# Altium schematic sheet ProbadorManillaresCrio.SchDoc
size A3
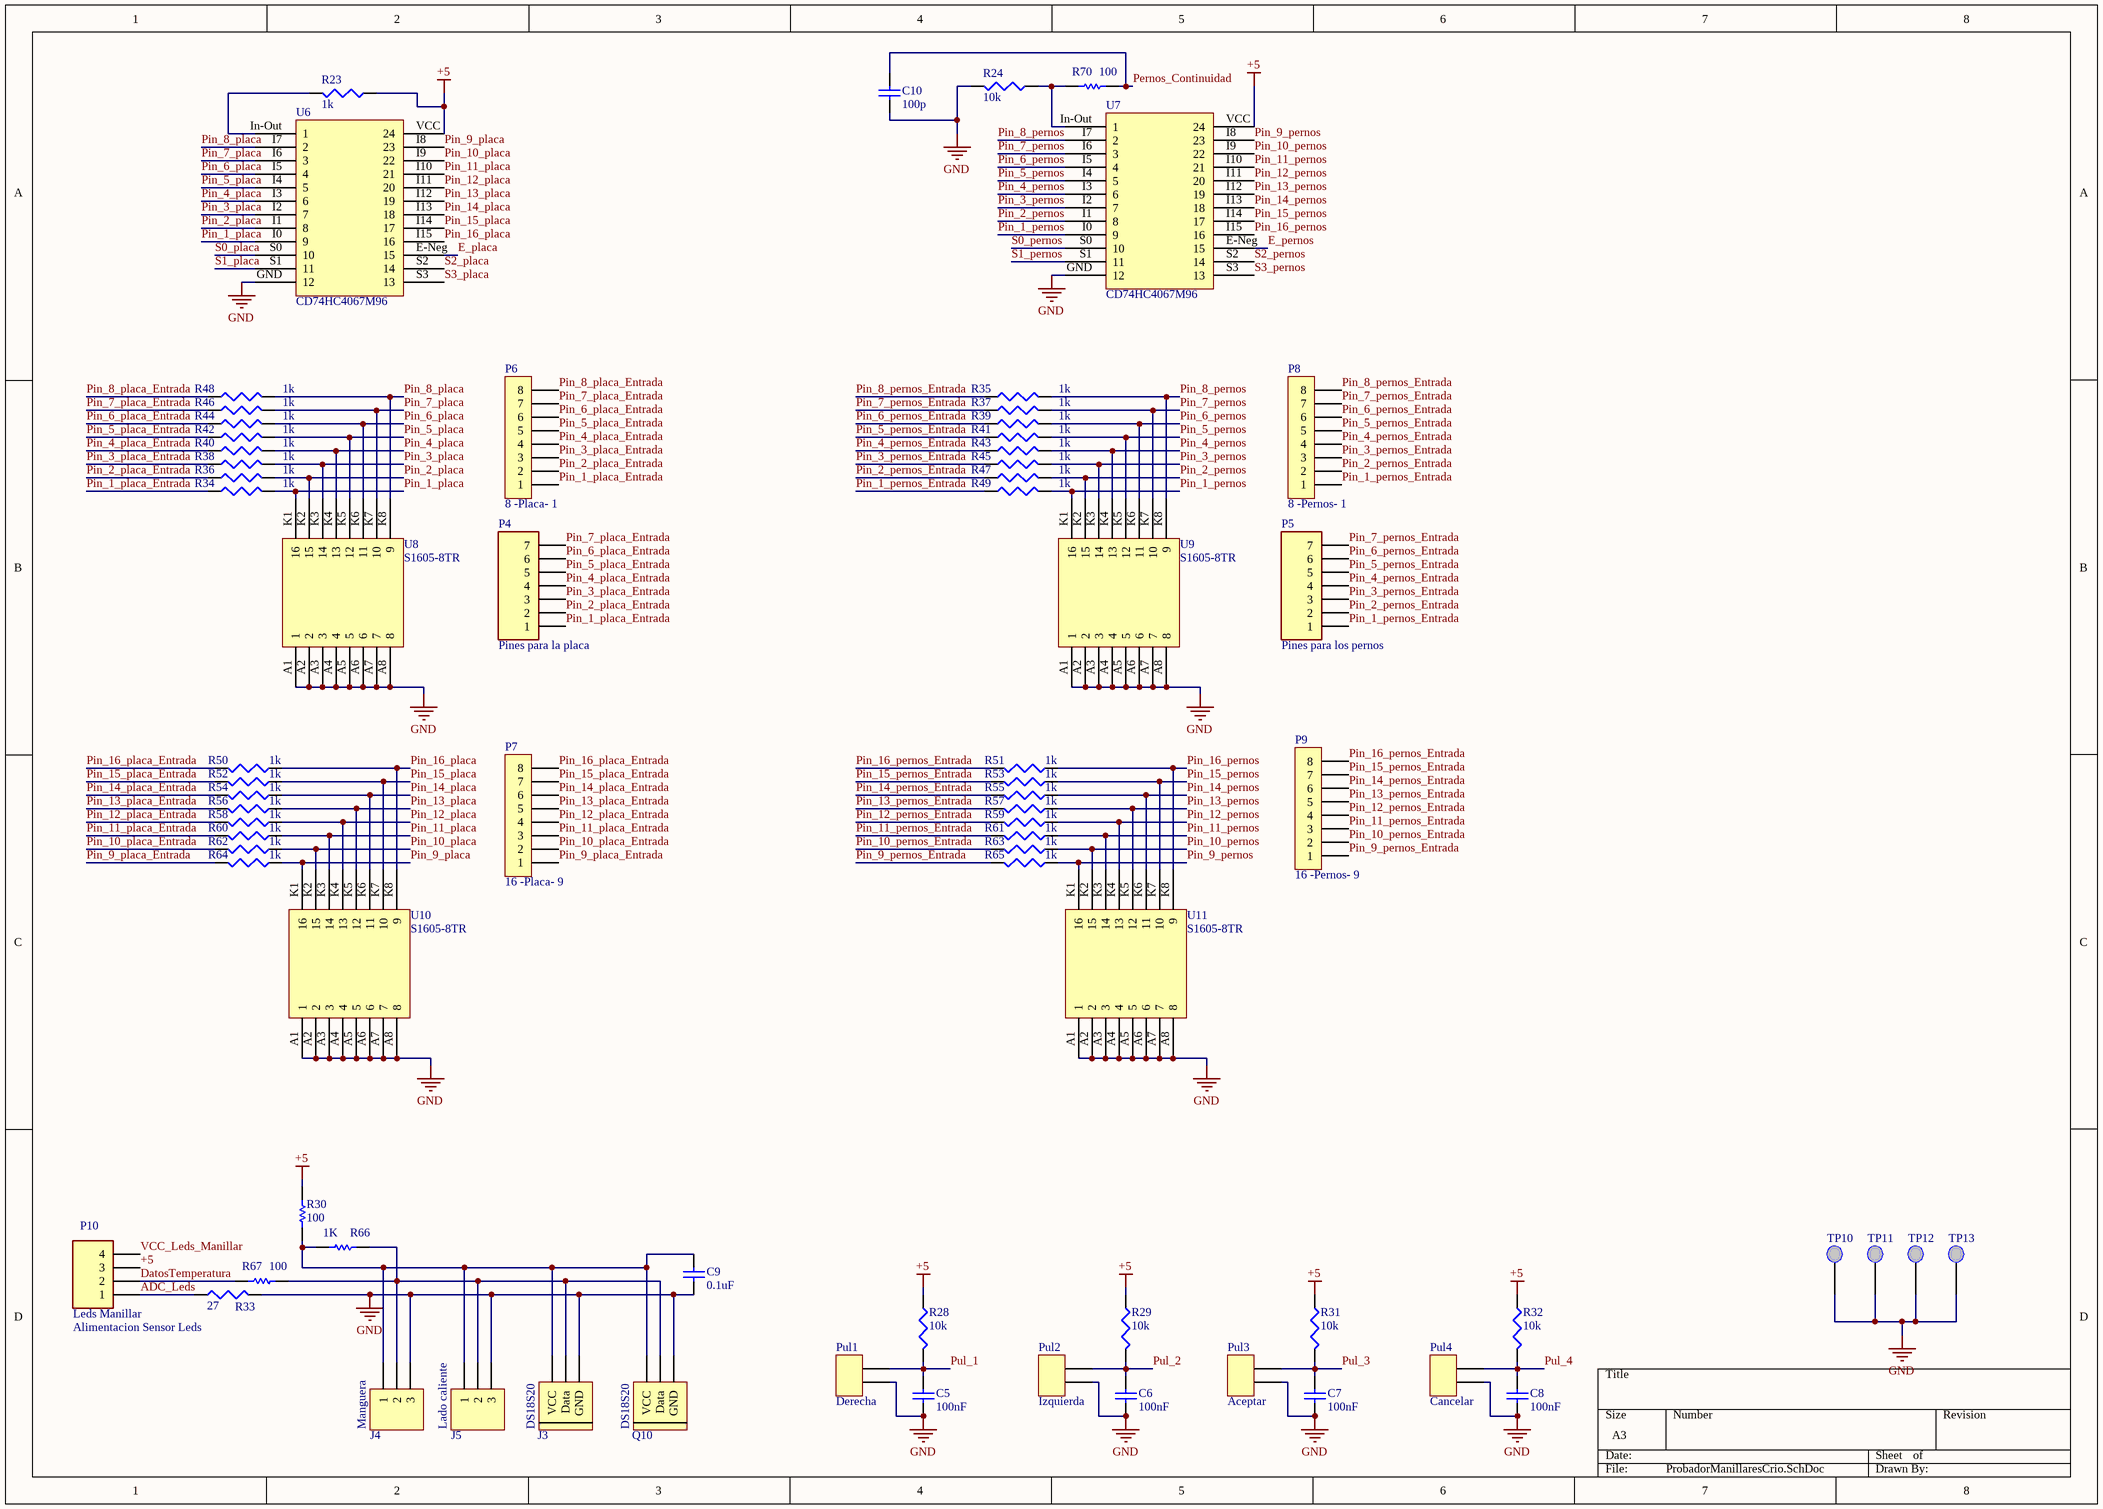
[diagram p0: ProbadorManillaresCrio.SchDoc]

## Parts
C5  100nF  [6-0805_M]
C6  100nF  [6-0805_M]
C7  100nF  [6-0805_M]
C8  100nF  [6-0805_M]
C9  0.1uF  [C_0805_3D]
C10  100p  [C_0805_3D]
J3  DS18S20  [DS18S20-ZocaloDirecto]
J4  Manguera  [B3B-XH-A_3D]
J5  Lado caliente  [B3B-XH-A_3D]
P4  Pines para la placa  [B7B-XH-A_3D]
P5  Pines para los pernos  [B7B-XH-A_3D]
P6  8 -Placa- 1  [PinesMacho8]
P7  16 -Placa- 9  [PinesMacho8]
P8  8 -Pernos- 1  [PinesMacho8]
P9  16 -Pernos- 9  [PinesMacho8]
P10  Leds Manillar  Funcion: Alimentacion Sensor Leds  [B4B-XH-A_3D]
Pul1  Derecha  [Jumper-Simple]
Pul2  Izquierda  [Jumper-Simple]
Pul3  Aceptar  [Jumper-Simple]
Pul4  Cancelar  [Jumper-Simple]
Q10  DS18S20  [TO92_123]
R23  1k  [6-0805_M]
R24  10k  [6-0805_M]
R28  10k  [6-0805_M]
R29  10k  [6-0805_M]
R30  100  [R_0805_3D]
R31  10k  [6-0805_M]
R32  10k  [6-0805_M]
R33  27  [6-0805_M]
R34  1k  [6-0805_M]
R35  1k  [6-0805_M]
R36  1k  [6-0805_M]
R37  1k  [6-0805_M]
R38  1k  [6-0805_M]
R39  1k  [6-0805_M]
R40  1k  [6-0805_M]
R41  1k  [6-0805_M]
R42  1k  [6-0805_M]
R43  1k  [6-0805_M]
R44  1k  [6-0805_M]
R45  1k  [6-0805_M]
R46  1k  [6-0805_M]
R47  1k  [6-0805_M]
R48  1k  [6-0805_M]
R49  1k  [6-0805_M]
R50  1k  [6-0805_M]
R51  1k  [6-0805_M]
R52  1k  [6-0805_M]
R53  1k  [6-0805_M]
R54  1k  [6-0805_M]
R55  1k  [6-0805_M]
R56  1k  [6-0805_M]
R57  1k  [6-0805_M]
R58  1k  [6-0805_M]
R59  1k  [6-0805_M]
R60  1k  [6-0805_M]
R61  1k  [6-0805_M]
R62  1k  [6-0805_M]
R63  1k  [6-0805_M]
R64  1k  [6-0805_M]
R65  1k  [6-0805_M]
R66  1K  [R_0805_3D]
R67  100  [R_0805_3D]
R70  100  [R_0805_3D]
TP10  GND  [TP-5002]  (value not drawn)
TP11  GND  [TP-5002]  (value not drawn)
TP12  GND  [TP-5002]  (value not drawn)
TP13  GND  [TP-5002]  (value not drawn)
U6  CD74HC4067M96  [SOIC24]
U7  CD74HC4067M96  [SOIC24]
U8  S1605-8TR  [SO16]
U9  S1605-8TR  [SO16]
U10  S1605-8TR  [SO16]
U11  S1605-8TR  [SO16]

## Nets
+5: P10.3 R23.1 R28.1 R29.1 R30.2 R31.1 R32.1 U6.VCC(24) U7.VCC(24)
GND: C5.1 C6.1 C7.1 C8.1 C9.1 C10.2 J3.1(GND) J4.3 J5.3 Pul1.2 Pul2.2 Pul3.2 Pul4.2 Q10.1(GND) R24.2 R33.2 TP10.1 TP11.1 TP12.1 TP13.1 U6.GND(12) U7.GND(12) U8.A1(1) U8.A2(2) U8.A3(3) U8.A4(4) U8.A5(5) U8.A6(6) U8.A7(7) U8.A8(8) U9.A1(1) U9.A2(2) U9.A3(3) U9.A4(4) U9.A5(5) U9.A6(6) U9.A7(7) U9.A8(8) U10.A1(1) U10.A2(2) U10.A3(3) U10.A4(4) U10.A5(5) U10.A6(6) U10.A7(7) U10.A8(8) U11.A1(1) U11.A2(2) U11.A3(3) U11.A4(4) U11.A5(5) U11.A6(6) U11.A7(7) U11.A8(8)
ADC_Leds: P10.1 R33.1
DatosTemperatura: P10.2 R67.1
E_pernos: U7.E-Neg(15)
E_placa: U6.E-Neg(15)
Pernos_Continuidad: C10.1 R70.2
Pin_1_pernos: R49.2 U7.I0(9) U9.K1(16)
Pin_1_pernos_Entrada: P5.1 P8.1 R49.1
Pin_1_placa: R34.2 U6.I0(9) U8.K1(16)
Pin_1_placa_Entrada: P4.1 P6.1 R34.1
Pin_2_pernos: R47.2 U7.I1(8) U9.K2(15)
Pin_2_pernos_Entrada: P5.2 P8.2 R47.1
Pin_2_placa: R36.2 U6.I1(8) U8.K2(15)
Pin_2_placa_Entrada: P4.2 P6.2 R36.1
Pin_3_pernos: R45.2 U7.I2(7) U9.K3(14)
Pin_3_pernos_Entrada: P5.3 P8.3 R45.1
Pin_3_placa: R38.2 U6.I2(7) U8.K3(14)
Pin_3_placa_Entrada: P4.3 P6.3 R38.1
Pin_4_pernos: R43.2 U7.I3(6) U9.K4(13)
Pin_4_pernos_Entrada: P5.4 P8.4 R43.1
Pin_4_placa: R40.2 U6.I3(6) U8.K4(13)
Pin_4_placa_Entrada: P4.4 P6.4 R40.1
Pin_5_pernos: R41.2 U7.I4(5) U9.K5(12)
Pin_5_pernos_Entrada: P5.5 P8.5 R41.1
Pin_5_placa: R42.2 U6.I4(5) U8.K5(12)
Pin_5_placa_Entrada: P4.5 P6.5 R42.1
Pin_6_pernos: R39.2 U7.I5(4) U9.K6(11)
Pin_6_pernos_Entrada: P5.6 P8.6 R39.1
Pin_6_placa: R44.2 U6.I5(4) U8.K6(11)
Pin_6_placa_Entrada: P4.6 P6.6 R44.1
Pin_7_pernos: R37.2 U7.I6(3) U9.K7(10)
Pin_7_pernos_Entrada: P5.7 P8.7 R37.1
Pin_7_placa: R46.2 U6.I6(3) U8.K7(10)
Pin_7_placa_Entrada: P4.7 P6.7 R46.1
Pin_8_pernos: R35.2 U7.I7(2) U9.K8(9)
Pin_8_pernos_Entrada: P8.8 R35.1
Pin_8_placa: R48.2 U6.I7(2) U8.K8(9)
Pin_8_placa_Entrada: P6.8 R48.1
Pin_9_pernos: R65.1 U7.I8(23) U11.K1(16)
Pin_9_pernos_Entrada: P9.1 R65.2
Pin_9_placa: R64.1 U6.I8(23) U10.K1(16)
Pin_9_placa_Entrada: P7.1 R64.2
Pin_10_pernos: R63.1 U7.I9(22) U11.K2(15)
Pin_10_pernos_Entrada: P9.2 R63.2
Pin_10_placa: R62.1 U6.I9(22) U10.K2(15)
Pin_10_placa_Entrada: P7.2 R62.2
Pin_11_pernos: R61.1 U7.I10(21) U11.K3(14)
Pin_11_pernos_Entrada: P9.3 R61.2
Pin_11_placa: R60.1 U6.I10(21) U10.K3(14)
Pin_11_placa_Entrada: P7.3 R60.2
Pin_12_pernos: R59.1 U7.I11(20) U11.K4(13)
Pin_12_pernos_Entrada: P9.4 R59.2
Pin_12_placa: R58.1 U6.I11(20) U10.K4(13)
Pin_12_placa_Entrada: P7.4 R58.2
Pin_13_pernos: R57.1 U7.I12(19) U11.K5(12)
Pin_13_pernos_Entrada: P9.5 R57.2
Pin_13_placa: R56.1 U6.I12(19) U10.K5(12)
Pin_13_placa_Entrada: P7.5 R56.2
Pin_14_pernos: R55.1 U7.I13(18) U11.K6(11)
Pin_14_pernos_Entrada: P9.6 R55.2
Pin_14_placa: R54.1 U6.I13(18) U10.K6(11)
Pin_14_placa_Entrada: P7.6 R54.2
Pin_15_pernos: R53.1 U7.I14(17) U11.K7(10)
Pin_15_pernos_Entrada: P9.7 R53.2
Pin_15_placa: R52.1 U6.I14(17) U10.K7(10)
Pin_15_placa_Entrada: P7.7 R52.2
Pin_16_pernos: R51.1 U7.I15(16) U11.K8(9)
Pin_16_pernos_Entrada: P9.8 R51.2
Pin_16_placa: R50.1 U6.I15(16) U10.K8(9)
Pin_16_placa_Entrada: P7.8 R50.2
Pul_1: C5.2 Pul1.1 R28.2
Pul_2: C6.2 Pul2.1 R29.2
Pul_3: C7.2 Pul3.1 R31.2
Pul_4: C8.2 Pul4.1 R32.2
S0_pernos: U7.S0(10)
S0_placa: U6.S0(10)
S1_pernos: U7.S1(11)
S1_placa: U6.S1(11)
S2_pernos: U7.S2(14)
S2_placa: U6.S2(14)
S3_pernos: U7.S3(13)
S3_placa: U6.S3(13)
VCC_Leds_Manillar: P10.4
NetC9_2: C9.2 J3.3(VCC) J4.1 J5.1 Q10.3(VCC) R30.1 R66.1
NetJ3_2: J3.2(Data) J4.2 J5.2 Q10.2(Data) R66.2 R67.2
NetR23_2: R23.2 U6.In-Out(1)
NetR24_1: R24.1 R70.1 U7.In-Out(1)

## Library data of the parts
C5-C8 = Cap: CAP CER 0.1UF 50V 10% X7R 0805; Cod.Fabricante: C0805C104K5RACTU; Fabricante: Kemet; PackageReference: 6-0805_M; PackageDescription: Radial Cap, Thru-Hole; 2 Leads; 0.3 in Pin Spacing; Value: 100nF; Cod.Digikey: 399-1170-1-ND; DIGIKEYx100: 0.08340
C9 = C_0805_3D: CAP CER 0.1UF 25V X7R 0805; Fabricante: KEMET; Cod.Fabricante: C0805C104K3RACTU; Note: Footprint corresponds to dimensions for bulk cassette packaging. This case size has tightened tolerances.; Px100: 0.02540; Published: 17-Jul-2002; LatestRevisionDate: 19-Mar-2004; LatestRevisionNote: Silkscreen size reduced.; PackageReference: 0805; Publisher: Altium Limited; Value: 0.1uF; Cod.Digikey: 399-1168-1-ND; DatasheetDocument: Mar-2001; PackageDocument: Mar-2001; Code_JEITA: 0805; Code_IPC: 2012[0805]; ComponentLink1Description: Manufacturer Link; ComponentLink1URL: http://www.kemet.com/; ComponentLink2Description: Datasheet; ComponentLink2URL: http://www.kemet.com/kemet/web/homepage/kechome.nsf/vapubfilesname/F3102TA.pdf/$file/F3102TA.pdf; DIGIKEYx100: 0.02540
C10 = C_0805_3D: CAP CER 100PF 25V X7R 0805; Fabricante: KEMET; Cod.Fabricante: C0805C101K3RAC7800; Published: 17-Jul-2002; LatestRevisionDate: 19-Mar-2004; LatestRevisionNote: Silkscreen size reduced.; PackageReference: 0805; Publisher: Altium Limited; Value: 100p; Cod.Digikey: 399-15002-1-ND; DatasheetDocument: Mar-2001; PackageDocument: Mar-2001; Code_JEITA: 0805; Code_IPC: 2012[0805]; ComponentLink1Description: Manufacturer Link; ComponentLink1URL: http://www.kemet.com/; ComponentLink2Description: Datasheet; ComponentLink2URL: http://www.kemet.com/kemet/web/homepage/kechome.nsf/vapubfilesname/F3102TA.pdf/$file/F3102TA.pdf; DIGIKEYx100: 0.12340
J3 = DS18S20-ZocaloDirecto: CONN HDR 3POS 0.1 GOLD PCB; Cod.Fabricante: PPPC031LFBN-RC; Fabricante: Sullins Connector Solutions; Cod.DigiKey: S7036-ND; ComponentLink1Description: Manufacturer Link; ComponentLink1URL: https://drawings-pdf.s3.amazonaws.com/10492.pdf; ComponentLink2Description: Datasheet; ComponentLink2URL: https://media.digikey.com/pdf/Data%20Sheets/Sullins%20PDFs/Female_Headers.100_DS.pdf; DatasheetVersion: *; DIGIKEYx10: 0.26910; LatestRevisionDate: *; LatestRevisionNote: *; PackageDescription: *; PackageReference: *; PackageVersion: *; Published: 29-sep-00; Publisher: Altium Limited; Value: *
J4 J5 = JST_2.5_3_1: CONN HEADER XH TOP 3POS 2.5MM; Cod.Fabricante: B3B-XH-A(LF)(SN); Fabricante: JST Sales America Inc.; LatestRevisionDate: 17-Jul-2002; LatestRevisionNote: Re-released for DXP Platform.; Publisher: Altium Limited; Cod.Digikey: 455-2248-ND; ComponentLink2Description: Datasheet; ComponentLink2URL: http://www.jst-mfg.com/product/pdf/eng/eXH.pdf; DIGIKEYx100: 0.1115
P4 = JST_2.5_7: CONN HEADER XH TOP 7POS 2.5MM; Cod.Fabricante: B7B-XH-A(LF)(SN); Fabricante: JST Sales America Inc.; Funcion: Pines para los pernos; LatestRevisionDate: 17-Jul-2002; LatestRevisionNote: Re-released for DXP Platform.; Publisher: Altium Limited; Cod.Digikey: 455-2252-ND; ComponentLink2Description: Datasheet; ComponentLink2URL: http://www.jst-mfg.com/product/pdf/eng/eXH.pdf; DIGIKEYx100: 0.2156
P5 = JST_2.5_7: CONN HEADER XH TOP 7POS 2.5MM; Cod.Fabricante: B7B-XH-A(LF)(SN); Fabricante: JST Sales America Inc.; LatestRevisionDate: 17-Jul-2002; LatestRevisionNote: Re-released for DXP Platform.; Publisher: Altium Limited; Cod.Digikey: 455-2252-ND; ComponentLink2Description: Datasheet; ComponentLink2URL: http://www.jst-mfg.com/product/pdf/eng/eXH.pdf; DIGIKEYx100: 0.2156; Funcion: Pines para los pernos
P6-P9 = PinesMacho8: Connector Header Through Hole 8 position 0.100" (2.54mm); Cod.Fabricante: 61300811121; Fabricante: Wurth Electronics Inc.; Cod.DigiKey: 732-5321-ND; ComponentLink1Description: Manufacturer Link; ComponentLink1URL: https://katalog.we-online.de/em/datasheet/6130xx11121.pdf; ComponentLink2Description: Datasheet; ComponentLink2URL: *; DatasheetVersion: *; DIGIKEYx100: 0.19900; LatestRevisionDate: *; LatestRevisionNote: *; PackageDescription: *; PackageReference: *; PackageVersion: *; Published: 29-sep-00; Publisher: Altium Limited; Value: *
P10 = JST_2.5_4: CONN HEADER XH TOP 4POS 2.5MM; Cod.Fabricante: B4B-XH-A(LF)(SN); Fabricante: JST Sales America Inc.; LatestRevisionDate: 17-Jul-2002; LatestRevisionNote: Re-released for DXP Platform.; Publisher: Altium Limited; Cod.Digikey: 455-2249-ND; ComponentLink2Description: Datasheet; ComponentLink2URL: http://www.jst-mfg.com/product/pdf/eng/eXH.pdf; DIGIKEYx100: 0.1348
Pul1-Pul4 = Jumper-Simple: CONN HEADER 2 POS 2.54; Cod.Fabricante: 61300211121; Fabricante: Wurth Electronics Inc.; Cod.DigiKey: 732-5315-ND; ComponentLink1Description: Manufacturer Link; ComponentLink1URL: https://katalog.we-online.de/em/datasheet/6130xx11121.pdf; ComponentLink2Description: Datasheet; ComponentLink2URL: *; DatasheetVersion: *; DIGIKEYx100: 0.06700; LatestRevisionDate: *; LatestRevisionNote: *; PackageDescription: *; PackageReference: *; PackageVersion: *; Published: 29-sep-00; Publisher: Altium Limited; Value: Jumper-Simple
Q10 = DS18S20-Soldado: Temperature Sensor Digital, Local -55°C ~ 125°C 8 b TO-92-3; Cod.Fabricante: DS18S20+; Fabricante: Maxim Integrated; Cod.DigiKey: DS18S20+-ND; ComponentLink1Description: Manufacturer Link; ComponentLink1URL: https://datasheets.maximintegrated.com/en/ds/DS18S20.pdf; ComponentLink2Description: Datasheet; ComponentLink2URL: *; DatasheetVersion: *; DIGIKEYx10: 2.96300; LatestRevisionDate: *; LatestRevisionNote: *; PackageDescription: *; PackageReference: TO92; PackageVersion: *; Published: 29-sep-00; Publisher: Altium Limited; Value: DS18S20
R23 R34-R65 = Res3: RES SMD 1K OHM 1% 1/8W 0805; Cod.Fabricante: RC0805FR-071KL; Fabricante: Yageo; PackageReference: 6-0805_M; PackageDescription: Chip Resistor; Value: 1k; Cod.Digikey: 311-1.00KCRCT-ND; ComponentLink1Description: Manufacturer Link; ComponentLink1URL: http://www.yageo.com/documents/recent/PYu-RC_Group_51_RoHS_L_10.pdf; ComponentLink2Description: Datasheet; ComponentLink2URL: http://www.yageo.com/exep/pages/download/literatures/PYu-R_Marking_2.pdf; DatasheetVersion: 1996; DIGIKEYx100: 0.017; LatestRevisionDate: 17-jul-02; LatestRevisionNote: Re-released for DXP Platform.; PackageVersion: *; Published: *; Publisher: *
R24 R28 R29 R31 R32 = Res3: RES SMD 10K OHM 1% 1/8W 0805; Cod.Fabricante: RC0805FR-0710KL; Fabricante: Yageo; PackageReference: 6-0805_M; PackageDescription: Chip Resistor; Value: 10k; Cod.Digikey: 311-10.0KCRCT-ND; ComponentLink1Description: Manufacturer Link; ComponentLink1URL: http://www.yageo.com/documents/recent/PYu-RC_Group_51_RoHS_L_10.pdf; ComponentLink2Description: Datasheet; ComponentLink2URL: http://www.yageo.com/exep/pages/download/literatures/PYu-R_Marking_2.pdf; DatasheetVersion: 1996; DIGIKEYx100: 0.017; LatestRevisionDate: 17-jul-02; LatestRevisionNote: Re-released for DXP Platform.; PackageVersion: *; Published: *; Publisher: *
R30 R67 R70 = R_0805_3D: RES SMD 100 OHM 1% 1/8W 0805; Cod.Fabricante: RC0805FR-07100RL; Fabricante: Yageo; Published: 8-Jun-2000; LatestRevisionDate: 17-Jul-2002; LatestRevisionNote: Re-released for DXP Platform.; PackageReference: 0805; Publisher: Altium Limited; PackageDescription: 0805; Cod.Digikey: 311-100CRCT-ND; Value: 100; DIGIKEYx100: 0.0088
R33 = Res3: RES SMD 27 OHM 1% 1/8W 0805; Cod.Fabricante: RC0805FR-0727RL; Fabricante: Yageo; PackageReference: 6-0805_M; PackageDescription: Chip Resistor; Value: 27; Cod.Digikey: 311-27.0CRCT-ND; ComponentLink1Description: Manufacturer Link; ComponentLink1URL: http://www.yageo.com/documents/recent/PYu-RC_Group_51_RoHS_L_10.pdf; ComponentLink2Description: Datasheet; ComponentLink2URL: http://www.yageo.com/exep/pages/download/literatures/PYu-R_Marking_2.pdf; DatasheetVersion: 1996; DIGIKEYx100: 0.017; LatestRevisionDate: 17-jul-02; LatestRevisionNote: Re-released for DXP Platform.; PackageVersion: *; Published: *; Publisher: *
R66 = R_0805_3D: RES SMD 1K OHM 1% 1/8W 0805; Cod.Fabricante: RC0805FR-071KL; Fabricante: Yageo; Published: 8-Jun-2000; LatestRevisionDate: 17-Jul-2002; LatestRevisionNote: Re-released for DXP Platform.; PackageReference: 0805; Publisher: Altium Limited; PackageDescription: 0805; Cod.Digikey: 311-1.00KCRCT-ND; Value: 1K; DIGIKEYx100: 0.0088
TP10-TP13 = TestPoint: White PC Test Point, Miniature Phosphor Bronze, Silver Plating 0.040" (1.02mm) Hole Diameter Mounting Type; Cod.Fabricante: 5002; Fabricante: Keystone Electronics; Cod.DigiKey: 36-5002-ND; ComponentLink1Description: Manufacturer Link; ComponentLink1URL: http://www.keyelco.com/product-pdf.cfm?p=1311; ComponentLink2Description: Datasheet; ComponentLink2URL: *; DatasheetVersion: *; DIGIKEYx100: 0.22090; LatestRevisionDate: *; LatestRevisionNote: *; PackageDescription: *; PackageReference: *; PackageVersion: *; Published: 29-sep-00; Publisher: Altium Limited; Value: Test point
U6 U7 = CD74HC4067M96: IC MUX/DEMUX 1X16 24SOIC; Fabricante: Texas Instruments; Cod.DigiKey: 296-29408-1-ND; Cod.Fabricante: CD74HC4067M96; ComponentLink1Description: http://www.ti.com/lit/ds/symlink/cd74hc4067.pdf; ComponentLink1URL: http://www.ti.com/lit/ds/symlink/cd74hc4067.pdf; DatasheetVersion: *; DIGIKEYx100: 0.53940; PackageReference: SOIC24; Value: CD74HC4067M96
U8-U11 = S1605-8TR: 9.8V Clamp 1A Ipp Tvs Diode Surface Mount 16-SO; Fabricante: SMC Diode Solutions; Cod.DigiKey: 1655-2148-1-ND; Cod.Fabricante: S1605-8TR; ComponentLink1Description: http://www.smc-diodes.com/propdf/S1603-8%20THRU%20S1624-8%20N0293%20REV.A.pdf; ComponentLink1URL: https://www.digikey.com/catalog/en/partgroup/s16xx-8-series/62484?mpart=S1605-8TR&vendor=1655; DatasheetVersion: *; DIGIKEYx100: 0.68070; PackageReference: SO16; Value: S1605-8TR